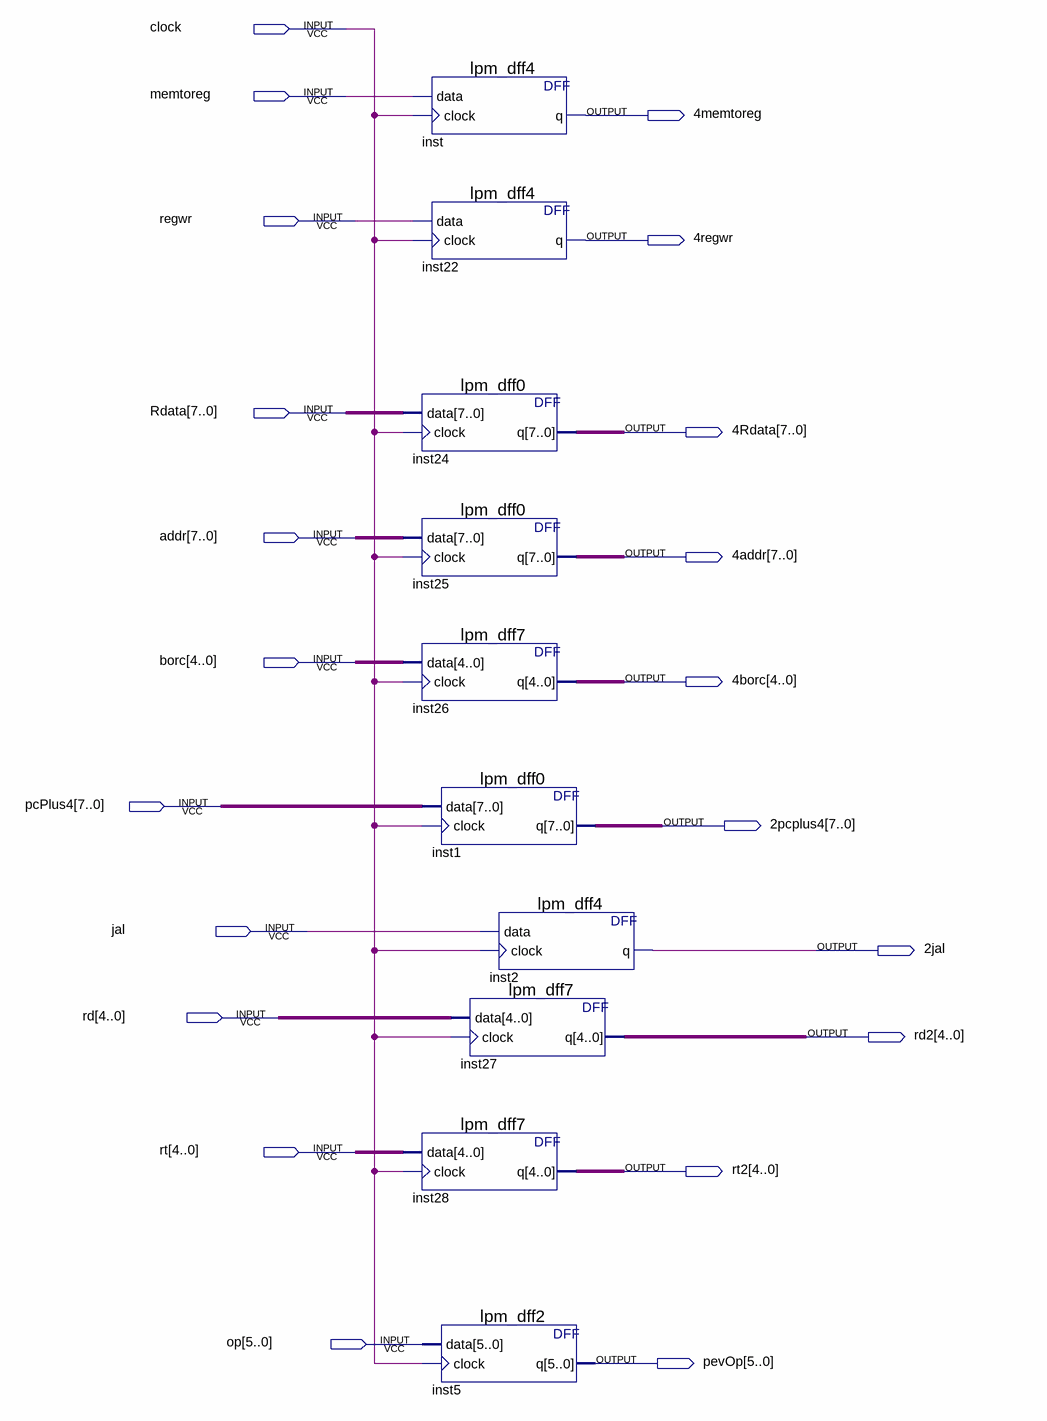
[diagram p0: schematic sheet]
// Quartus schematic Mem_WB.bdf as structural Verilog: 10 symbols, 21 pins
module Mem_WB (
  input  clock,
  input  memtoreg,
  input  regwr,
  input  [7:0] Rdata,
  input  [7:0] addr,
  input  [4:0] borc,
  input  [7:0] pcPlus4,
  input  jal,
  input  [4:0] rd,
  input  [4:0] rt,
  input  [5:0] op,
  output \4memtoreg ,
  output \4regwr ,
  output [7:0] \4Rdata ,
  output [7:0] \4addr ,
  output [4:0] \4borc ,
  output [7:0] \2pcplus4 ,
  output \2jal ,
  output [4:0] rd2,
  output [4:0] rt2,
  output [5:0] pevOp
);

  lpm_dff4 inst (.data(memtoreg), .clock(clock), .q(\4memtoreg ));
  lpm_dff4 inst22 (.data(regwr), .clock(clock), .q(\4regwr ));
  lpm_dff0 inst24 (.data(Rdata), .clock(clock), .q(\4Rdata ));
  lpm_dff0 inst25 (.data(addr), .clock(clock), .q(\4addr ));
  lpm_dff7 inst26 (.data(borc), .clock(clock), .q(\4borc ));
  lpm_dff0 inst1 (.data(pcPlus4), .clock(clock), .q(\2pcplus4 ));
  lpm_dff7 inst27 (.data(rd), .clock(clock), .q(rd2));
  lpm_dff7 inst28 (.data(rt), .clock(clock), .q(rt2));
  lpm_dff2 inst5 (.data(op), .clock(clock), .q(pevOp));
  lpm_dff4 inst2 (.data(jal), .clock(clock), .q(\2jal ));
endmodule
